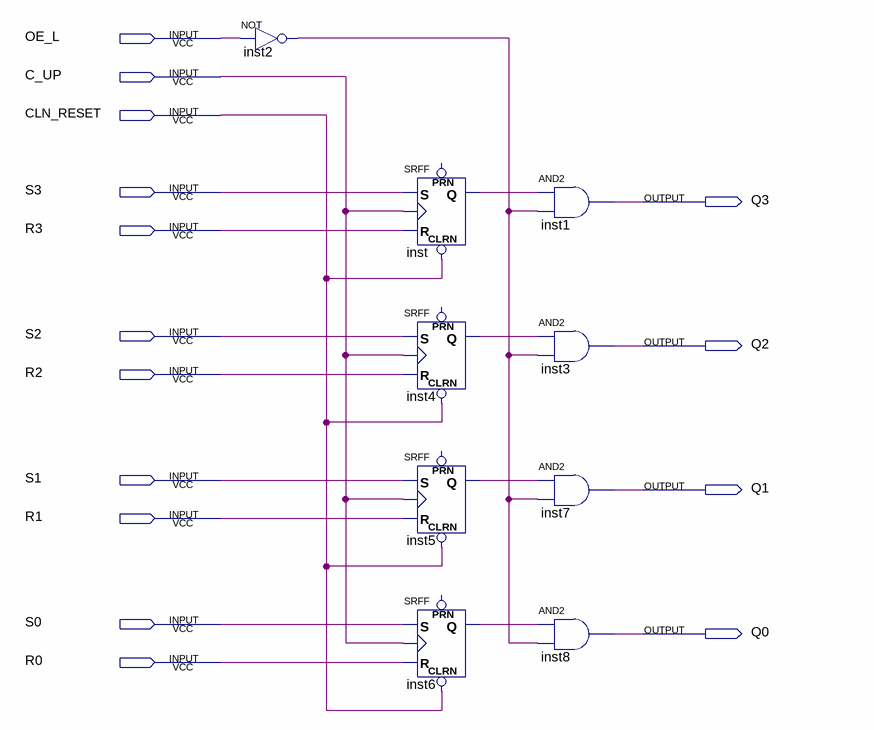
[diagram p0: schematic sheet]
// Quartus schematic Laboratory_work_5_1_OEL_project.bdf as structural Verilog: 9 symbols, 15 pins
module Laboratory_work_5_1_OEL_project (
  input  OE_L,
  input  C_UP,
  input  CLN_RESET,
  input  S3,
  input  R3,
  input  S2,
  input  R2,
  input  S1,
  input  R1,
  input  S0,
  input  R0,
  output Q3,
  output Q2,
  output Q1,
  output Q0
);

  wire inst2_out, inst4_q, inst5_q, inst6_q, inst_q;

  not inst2 (inst2_out, OE_L);
  SRFF inst (.CLRN(CLN_RESET), .S(S3), .R(R3), .CLK(C_UP), .Q(inst_q));  // open: PRN
  SRFF inst4 (.CLRN(CLN_RESET), .S(S2), .R(R2), .CLK(C_UP), .Q(inst4_q));  // open: PRN
  SRFF inst5 (.CLRN(CLN_RESET), .S(S1), .R(R1), .CLK(C_UP), .Q(inst5_q));  // open: PRN
  SRFF inst6 (.CLRN(CLN_RESET), .S(S0), .R(R0), .CLK(C_UP), .Q(inst6_q));  // open: PRN
  and inst1 (Q3, inst_q, inst2_out);
  and inst3 (Q2, inst4_q, inst2_out);
  and inst7 (Q1, inst5_q, inst2_out);
  and inst8 (Q0, inst6_q, inst2_out);
endmodule
